# Altium project notus.PrjPcb
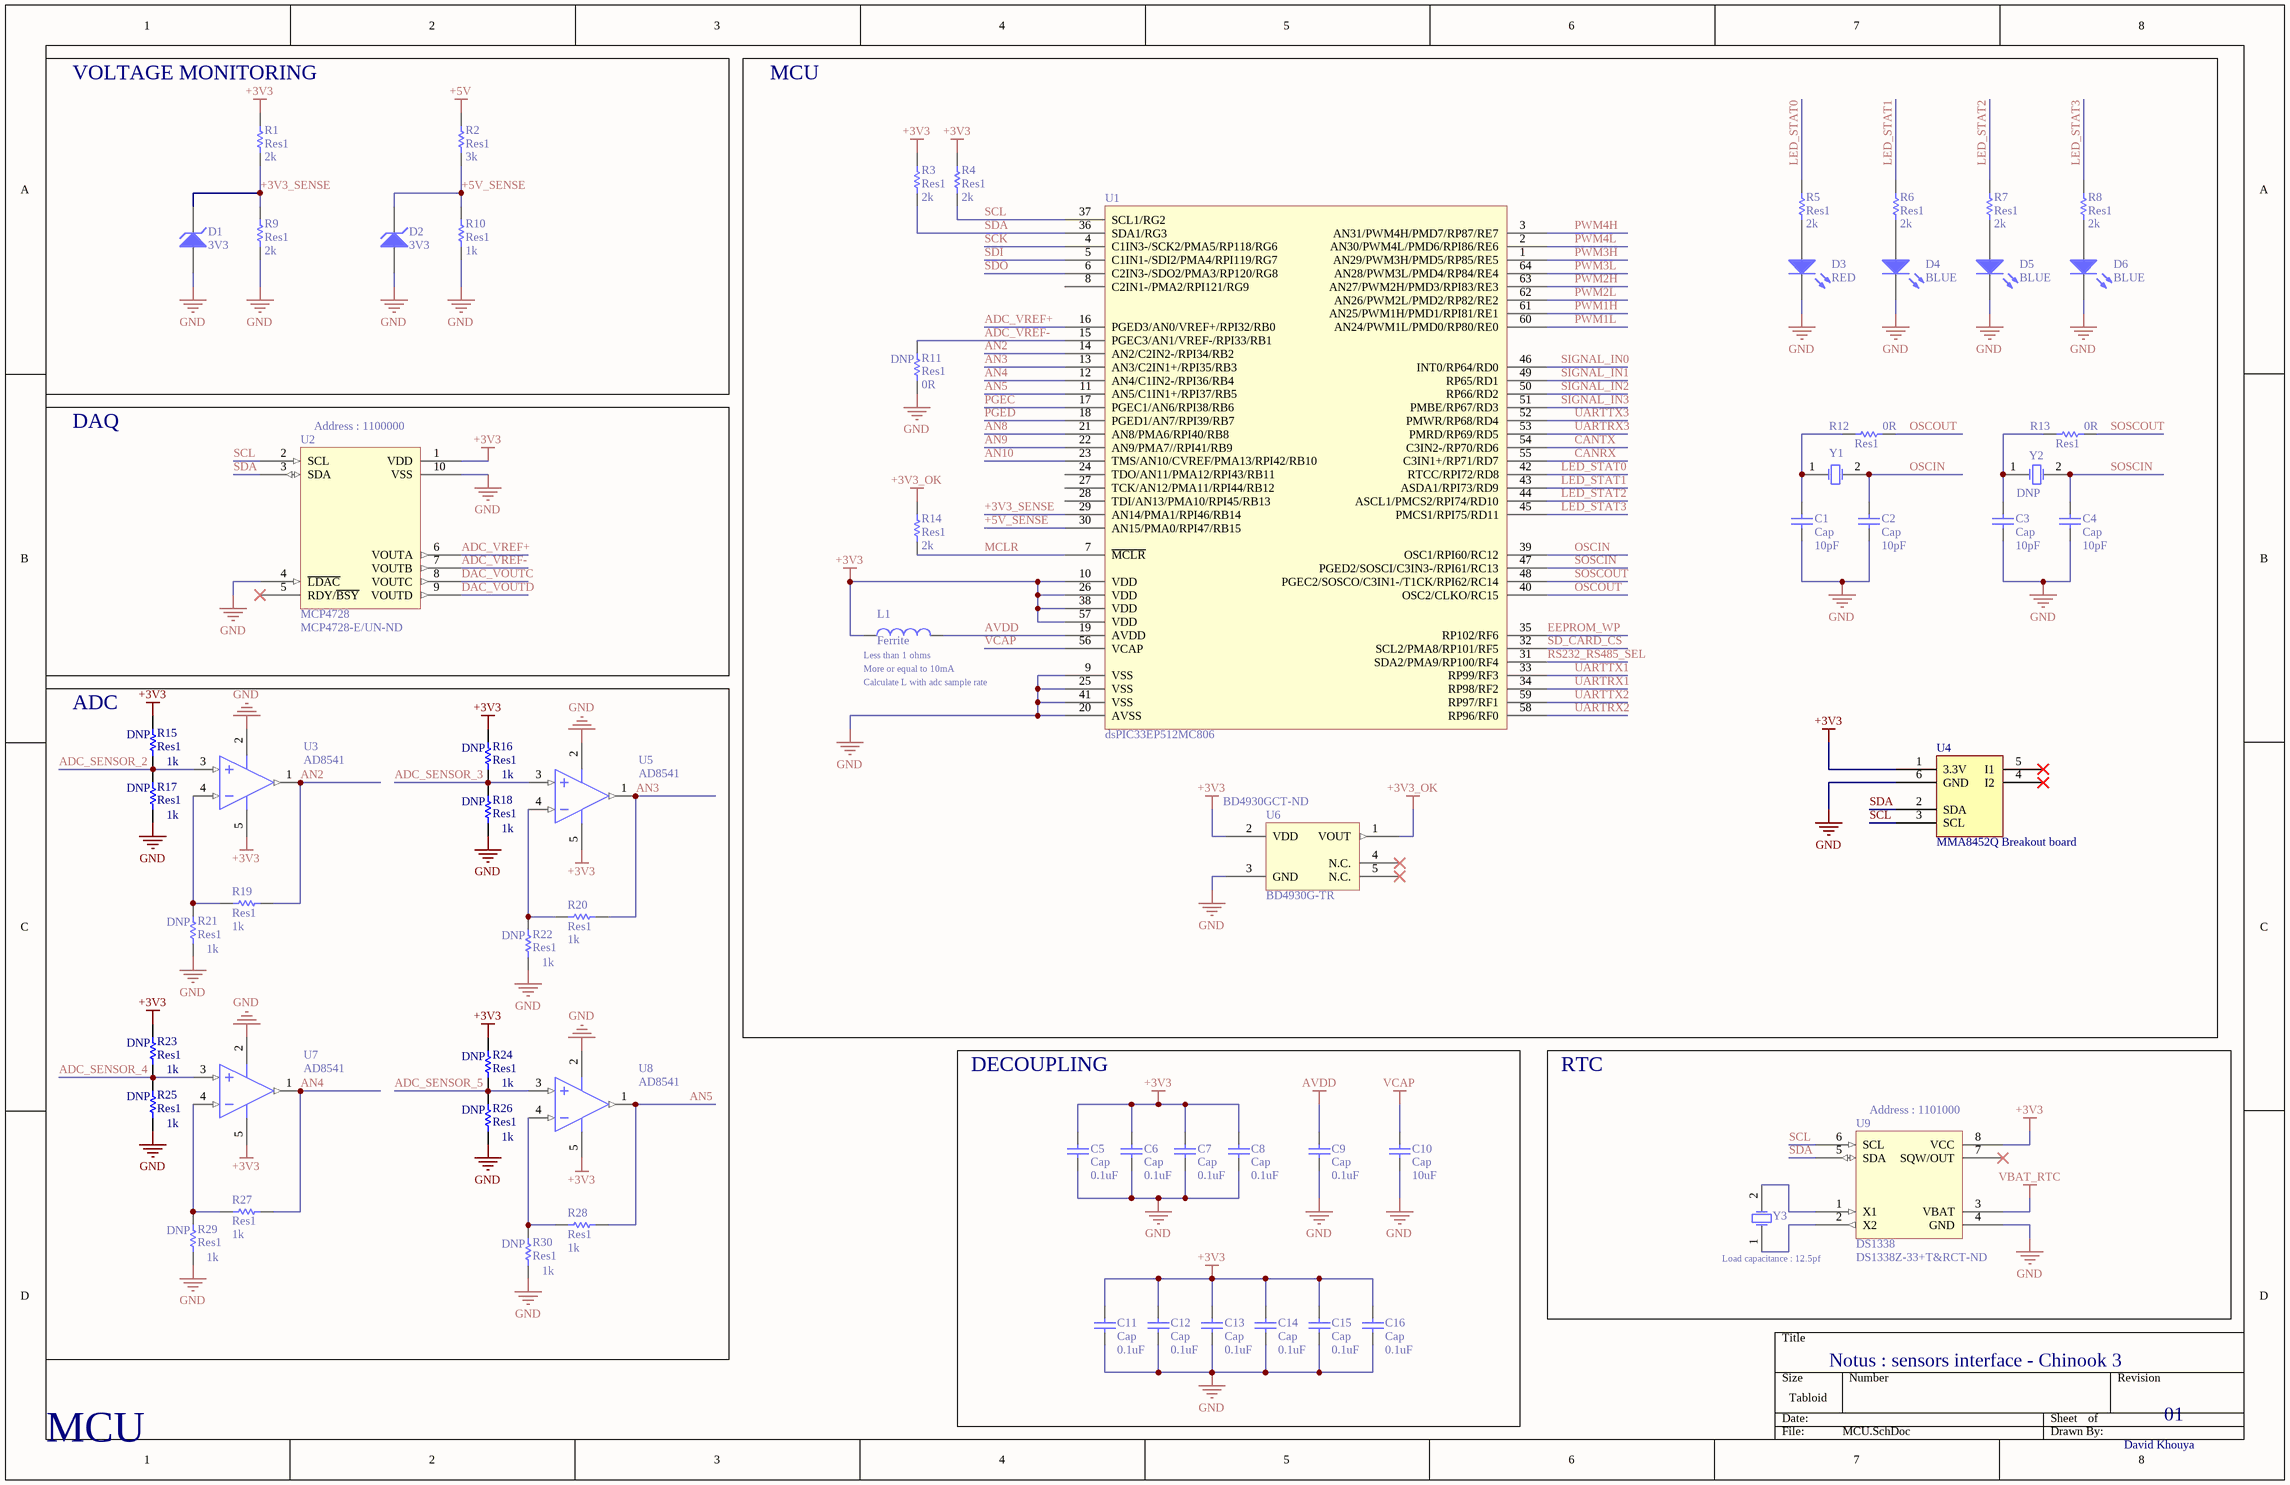
[diagram p0: MCU.SchDoc]
4 sheets, 110 parts. Net scope: global (net labels, ports and power ports of the same name join across sheets).
Board file: notus.PcbDoc
Sheets:
  MCU.SchDoc
  Memory.SchDoc
  Communication.SchDoc
  Connectors.SchDoc

## Sheet MCU.SchDoc
size Tabloid

### Parts
C1  Cap  value 10pF  [RESC2012N]
C2  Cap  value 10pF  [RESC2012N]
C3  Cap  value 10pF  [RESC2012N]
C4  Cap  value 10pF  [RESC2012N]
C5  Cap  value 0.1uF  [RESC2012N]
C6  Cap  value 0.1uF  [RESC2012N]
C7  Cap  value 0.1uF  [RESC2012N]
C8  Cap  value 0.1uF  [RESC2012N]
C9  Cap  value 0.1uF  [RESC2012N]
C10  Cap  value 10uF  [RESC2012N]
C11  Cap  value 0.1uF  [RESC2012N]
C12  Cap  value 0.1uF  [RESC2012N]
C13  Cap  value 0.1uF  [RESC2012N]
C14  Cap  value 0.1uF  [RESC2012N]
C15  Cap  value 0.1uF  [RESC2012N]
C16  Cap  value 0.1uF  [RESC2012N]
D1  3V3  [SOT23-3M]
D2  3V3  [SOT23-3M]
D3  RED  [0805_Diode]
D4  BLUE  [0805_Diode]
D5  BLUE  [0805_Diode]
D6  BLUE  [0805_Diode]
L1  Ferrite  [RESC2012N]
R1  Res1  value 2k  [RESC2012N]
R2  Res1  value 3k  [RESC2012N]
R3  Res1  value 2k  [RESC2012N]
R4  Res1  value 2k  [RESC2012N]
R5  Res1  value 2k  [RESC2012N]
R6  Res1  value 2k  [RESC2012N]
R7  Res1  value 2k  [RESC2012N]
R8  Res1  value 2k  [RESC2012N]
R9  Res1  value 2k  [RESC2012N]
R10  Res1  value 1k  [RESC2012N]
R11  Res1  value 0R  [RESC2012N]
R12  Res1  value 0R  [RESC2012N]
R13  Res1  value 0R  [RESC2012N]
R14  Res1  value 2k  [RESC2012N]
R15  Res1  value 1k  [RESC2012N]
R16  Res1  value 1k  [RESC2012N]
R17  Res1  value 1k  [RESC2012N]
R18  Res1  value 1k  [RESC2012N]
R19  Res1  value 1k  [RESC2012N]
R20  Res1  value 1k  [RESC2012N]
R21  Res1  value 1k  [RESC2012N]
R22  Res1  value 1k  [RESC2012N]
R23  Res1  value 1k  [RESC2012N]
R24  Res1  value 1k  [RESC2012N]
R25  Res1  value 1k  [RESC2012N]
R26  Res1  value 1k  [RESC2012N]
R27  Res1  value 1k  [RESC2012N]
R28  Res1  value 1k  [RESC2012N]
R29  Res1  value 1k  [RESC2012N]
R30  Res1  value 1k  [RESC2012N]
U1  dsPIC33EP512MC806  [TQFP-PT64_M]
U2  MCP4728  Supplier Part Number 1: MCP4728-E/UN-ND
U3  AD8541  [RT-5]
U4  MMA8452Q Breakout board  [MMA8452Q Breakout board]
U5  AD8541  [RT-5]
U6  BD4930G-TR  Supplier Part Number 1: BD4930GCT-ND  [SSOP5]
U7  AD8541  [RT-5]
U8  AD8541  [RT-5]
U9  DS1338  Supplier Part Number 1: DS1338Z-33+T&RCT-ND  [8SOIC-1]
Y1  (no value)  [HC49/4H_SMX]
Y2  (no value)  [HC49/4H_SMX]
Y3  (no value)  [crystalcustom]

### Blocks framed on the sheet
VOLTAGE MONITORING: D1 D2 R1 R2 R9 R10
MCU: C1-C4 D3-D6 L1 R3-R8 R11-R14 U1 U4 U6 Y1 Y2
DAQ: U2
ADC: R15-R30 U3 U5 U7 U8
DECOUPLING: C5-C16
RTC: U9 Y3

### Nets
+3V3: C5.2 C6.2 C7.2 C8.2 C11.2 C12.2 C13.2 C14.2 C15.2 C16.2 L1.1 R1.1 R3.1 R4.1 R15.1 R16.1 R23.1 R24.1 U1.10(VDD) U1.26(VDD) U1.38(VDD) U1.57(VDD) U2.1(VDD) U3.5(V+) U4.1(3.3V) U5.5(V+) U6.2(VDD) U7.5(V+) U8.5(V+) U9.8(VCC)
+3V3_OK: R14.1 U6.1(VOUT)
+5V: R2.1
AVDD: C9.2 L1.2 U1.19(AVDD)
GND: C1.1 C2.1 C3.1 C4.1 C5.1 C6.1 C7.1 C8.1 C9.1 C10.1 C11.1 C12.1 C13.1 C14.1 C15.1 C16.1 D1.1(A) D2.1(A) D3.2(K) D4.2(K) D5.2(K) D6.2(K) R9.2 R10.2 R11.2 R17.2 R18.2 R21.2 R22.2 R25.2 R26.2 R29.2 R30.2 U1.9(VSS) U1.20(AVSS) U1.25(VSS) U1.41(VSS) U2.4(~{LDAC}) U2.10(VSS) U3.2(V-) U4.6(GND) U5.2(V-) U6.3(GND) U7.2(V-) U8.2(V-) U9.4(GND)
VBAT_RTC: U9.3(VBAT)
VCAP: C10.2 U1.56(VCAP)
+3V3_SENSE: D1.2(K) R1.2 R9.1 U1.29(AN14/PMA1/RPI46/RB14)
+5V_SENSE: D2.2(K) R2.2 R10.1 U1.30(AN15/PMA0/RPI47/RB15)
ADC_SENSOR_2: R15.2 R17.1 U3.3(IN+_A)
ADC_SENSOR_3: R16.2 R18.1 U5.3(IN+_A)
ADC_SENSOR_4: R23.2 R25.1 U7.3(IN+_A)
ADC_SENSOR_5: R24.2 R26.1 U8.3(IN+_A)
ADC_VREF+: U1.16(PGED3/AN0/VREF+/RPI32/RB0) U2.6(VOUTA)
ADC_VREF-: R11.1 U1.15(PGEC3/AN1/VREF-/RPI33/RB1) U2.7(VOUTB)
AN2: R19.2 U1.14(AN2/C2IN2-/RPI34/RB2) U3.1(OUT_A)
AN3: R20.2 U1.13(AN3/C2IN1+/RPI35/RB3) U5.1(OUT_A)
AN4: R27.2 U1.12(AN4/C1IN2-/RPI36/RB4) U7.1(OUT_A)
AN5: R28.2 U1.11(AN5/C1IN1+/RPI37/RB5) U8.1(OUT_A)
AN8: U1.21(AN8/PMA6/RPI40/RB8)
AN9: U1.22(AN9/PMA7//RPI41/RB9)
AN10: U1.23(TMS/AN10/CVREF/PMA13/RPI42/RB10)
CANRX: U1.55(C3IN1+/RP71/RD7)
CANTX: U1.54(C3IN2-/RP70/RD6)
DAC_VOUTC: U2.8(VOUTC)
DAC_VOUTD: U2.9(VOUTD)
EEPROM_WP: U1.35(RP102/RF6)
LED_STAT0: R5.1 U1.42(RTCC/RPI72/RD8)
LED_STAT1: R6.1 U1.43(ASDA1/RPI73/RD9)
LED_STAT2: R7.1 U1.44(ASCL1/PMCS2/RPI74/RD10)
LED_STAT3: R8.1 U1.45(PMCS1/RPI75/RD11)
MCLR: R14.2 U1.7(~{MCLR})
OSCIN: C2.2 U1.39(OSC1/RPI60/RC12) Y1.2(OSC2)
OSCOUT: R12.1 U1.40(OSC2/CLKO/RC15)
PGEC: U1.17(PGEC1/AN6/RPI38/RB6)
PGED: U1.18(PGED1/AN7/RPI39/RB7)
PWM1H: U1.61(AN25/PWM1H/PMD1/RPI81/RE1)
PWM1L: U1.60(AN24/PWM1L/PMD0/RP80/RE0)
PWM2H: U1.63(AN27/PWM2H/PMD3/RPI83/RE3)
PWM2L: U1.62(AN26/PWM2L/PMD2/RP82/RE2)
PWM3H: U1.1(AN29/PWM3H/PMD5/RP85/RE5)
PWM3L: U1.64(AN28/PWM3L/PMD4/RP84/RE4)
PWM4H: U1.3(AN31/PWM4H/PMD7/RP87/RE7)
PWM4L: U1.2(AN30/PWM4L/PMD6/RPI86/RE6)
RS232_RS485_SEL: U1.31(SDA2/PMA9/RP100/RF4)
SCK: U1.4(C1IN3-/SCK2/PMA5/RP118/RG6)
SCL: R4.2 U1.37(SCL1/RG2) U2.2(SCL) U4.3(SCL) U9.6(SCL)
SD_CARD_CS: U1.32(SCL2/PMA8/RP101/RF5)
SDA: R3.2 U1.36(SDA1/RG3) U2.3(SDA) U4.2(SDA) U9.5(SDA)
SDI: U1.5(C1IN1-/SDI2/PMA4/RPI119/RG7)
SDO: U1.6(C2IN3-/SDO2/PMA3/RP120/RG8)
SIGNAL_IN0: U1.46(INT0/RP64/RD0)
SIGNAL_IN1: U1.49(RP65/RD1)
SIGNAL_IN2: U1.50(RP66/RD2)
SIGNAL_IN3: U1.51(PMBE/RP67/RD3)
SOSCIN: C4.2 U1.47(PGED2/SOSCI/C3IN3-/RPI61/RC13) Y2.2(OSC2)
SOSCOUT: R13.1 U1.48(PGEC2/SOSCO/C3IN1-/T1CK/RPI62/RC14)
UARTRX1: U1.34(RP98/RF2)
UARTRX2: U1.58(RP96/RF0)
UARTRX3: U1.53(PMRD/RP69/RD5)
UARTTX1: U1.33(RP99/RF3)
UARTTX2: U1.59(RP97/RF1)
UARTTX3: U1.52(PMWR/RP68/RD4)
NetC1_2: C1.2 R12.2 Y1.1(OSC1)
NetC3_2: C3.2 R13.2 Y2.1(OSC1)
NetD3_1: D3.1(A) R5.2
NetD4_1: D4.1(A) R6.2
NetD5_1: D5.1(A) R7.2
NetD6_1: D6.1(A) R8.2
NetR19_1: R19.1 R21.1 U3.4(IN-_A)
NetR20_1: R20.1 R22.1 U5.4(IN-_A)
NetR27_1: R27.1 R29.1 U7.4(IN-_A)
NetR28_1: R28.1 R30.1 U8.4(IN-_A)
NetU9_1: U9.1(X1) Y3.2(OSC2)
NetU9_2: U9.2(X2) Y3.1(OSC1)

Not connected (* = marked no-connect by the designer): U1 8(C2IN1-/PMA2/RPI121/RG9) 24(TDO/AN11/PMA12/RPI43/RB11) 27(TCK/AN12/PMA11/RPI44/RB12) 28(TDI/AN13/PMA10/RPI45/RB13); U2 5(RDY/~{BSY})*; U4 4(I2)* 5(I1)*; U6 4(N.C.)* 5(N.C.)*; U9 7(SQW/OUT)*

### Notes on the sheet
- (near U2) Address : 1100000
- (near L1) Less than 1 ohms
- (near L1) More or equal to 10mA
- (near L1) Calculate L with adc sample rate
- (near U9) Address : 1101000
- Load capacitance : 12.5pf
- Notus : sensors interface - Chinook 3
- 01
- MCU
- David Khouya

### Library data of the parts
C1-C16 = Cap: Capacitor; Published: 8-Jun-2000; LatestRevisionDate: 17-Jul-2002; LatestRevisionNote: Re-released for DXP Platform.; PackageReference: RAD-0.3; Publisher: Altium Limited; PackageDescription: Radial Cap, Thru-Hole; 2 Leads; 0.3 in Pin Spacing
D1 D2 = D Zener: Zener Diode; pin to pad: 2>3; Published: 8-Jun-2000; LatestRevisionDate: 17-Jul-2002; LatestRevisionNote: Re-released for DXP Platform.; PackageReference: DIODE-0.7; Publisher: Altium Limited; PackageDescription: Diode, Thru-Hole; 2 Leads; 0.7 in Pin Spacing
D3-D6 = LED0: Typical INFRARED GaAs LED; Published: 8-Jun-2000; LatestRevisionDate: 08-Jul-2005; LatestRevisionNote: Mech Layer 1 removed.; PackageReference: LED-0; Publisher: Altium Limited; PackageDescription: LED; 2 Leads
L1 = Inductor: Code_IEC: 1005; Published: 8-Jun-2000; LatestRevisionDate: 29-May-2009; LatestRevisionNote: IPC-7351 Footprint Added.; PackageReference: 0402-A; Publisher: Altium Limited; PackageDescription: Chip Inductor; Code_JEITA: 0402
R1-R30 = Res1: Resistor; Published: 8-Jun-2000; LatestRevisionDate: 17-Jul-2002; LatestRevisionNote: Re-released for DXP Platform.; PackageReference: AXIAL-0.3; Publisher: Altium Limited; PackageDescription: Axial Device, Thru-Hole; 2 Leads; 0.3 in Pin Spacing
  R11 R15-R18 R21-R26 R29 R30: DNP: DNP
U1 = dsPIC33EP512MC806: 16 bits microcontroller with Digital signal controller
U2 = MCP4728: 12-Bit, Quad Digital-to-Analog Converter with EEPROM Memory; Supplier 1: Digi-Key
U3 U5 U7 U8 = AD8541: CMOS Rail-to-Rail General-Purpose Amplifiers
U4 = MMA8452Q Breakout board: Triple axis accelerometer breakout board
U6 = BD4950G-TR: 5V Voltage supervisor; Supplier 1: Digi-Key
U9 = DS1338: I2C RTC with 56-Byte NV RAM; Supplier 1: Digi-Key
Y1-Y3 = XTAL: Crystal Oscillator; Published: 8-Jun-2000; LatestRevisionDate: 17-Jul-2002; LatestRevisionNote: Re-released for DXP Platform.; PackageReference: R38; Publisher: Altium Limited; PackageDescription: Crystal, Thru-Hole; 2 Leads; Body 3.1 x 8.2 mm (Dia.xH)
  Y2: DNP: DNP

## Sheet Memory.SchDoc
size A4
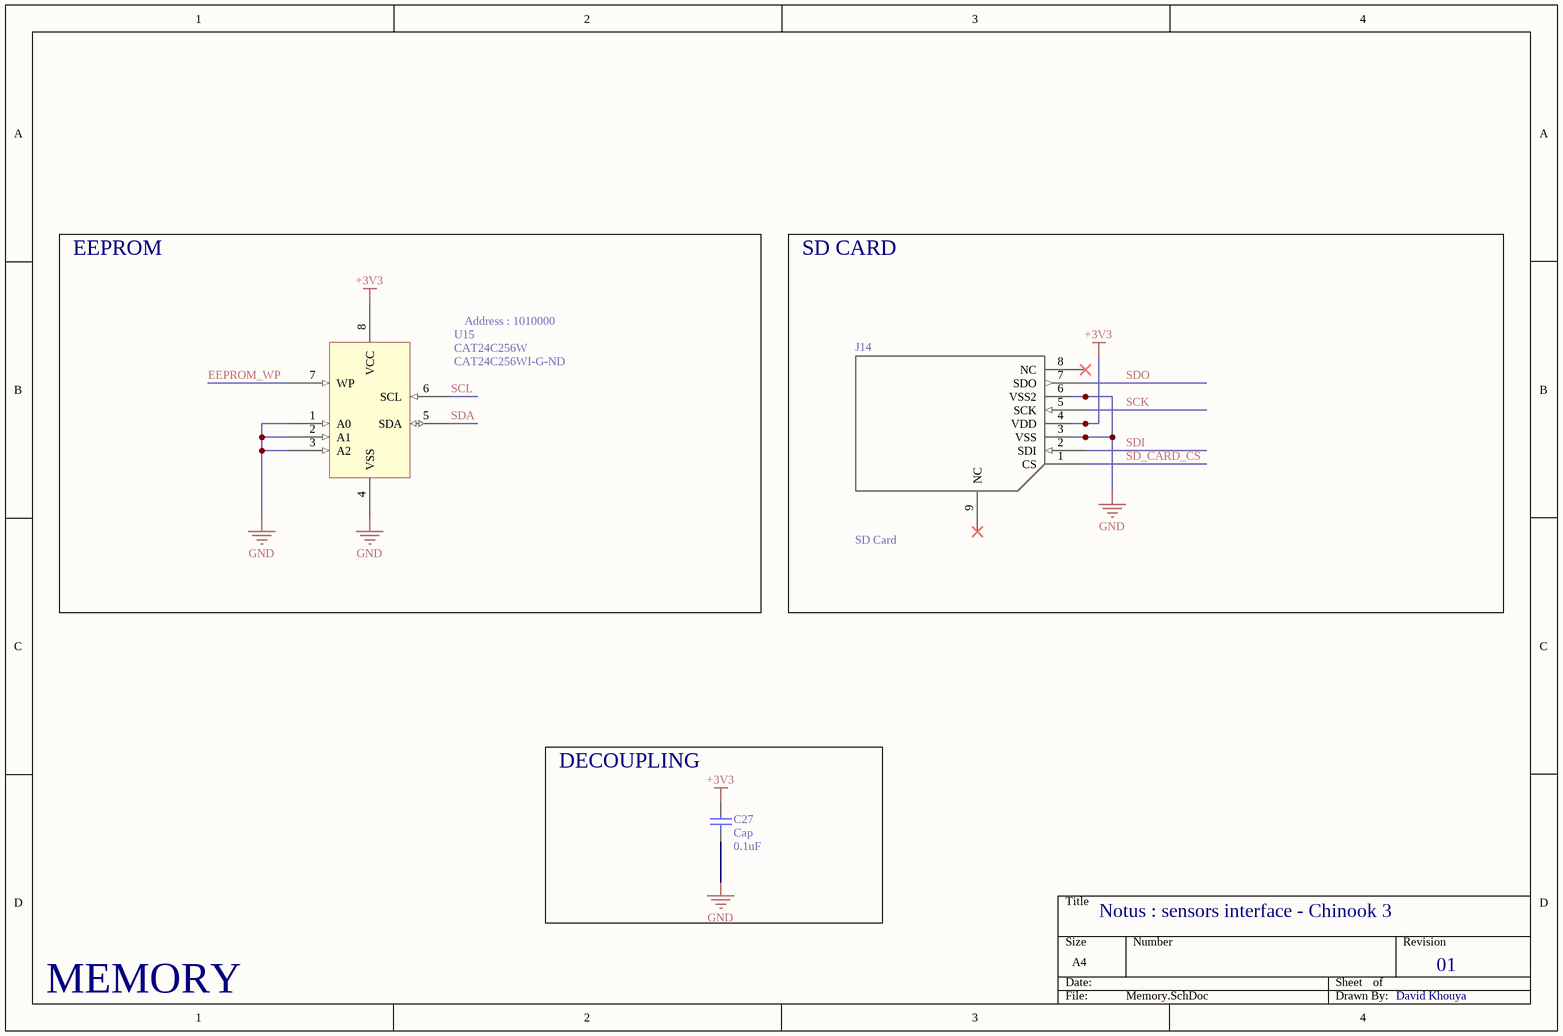
[diagram p1: Memory.SchDoc]

### Parts
C27  Cap  value 0.1uF  [RESC2012N]
J14  SD Card  [SD Card]
U15  CAT24C256W  Supplier Part Number 1: CAT24C256WI-G-ND  [8SOIC-2]

### Blocks framed on the sheet
EEPROM: U15
SD CARD: J14
DECOUPLING: C27

### Nets
+3V3: C27.2 J14.4(VDD) U15.8(VCC)
GND: C27.1 J14.3(VSS) J14.6(VSS2) U15.1(A0) U15.2(A1) U15.3(A2) U15.4(VSS)
EEPROM_WP: U15.7(WP)
SCK: J14.5(SCK)
SCL: U15.6(SCL)
SD_CARD_CS: J14.1(CS)
SDA: U15.5(SDA)
SDI: J14.2(SDI)
SDO: J14.7(SDO)

Not connected (* = marked no-connect by the designer): J14 8(NC)* 9(NC)*

### Notes on the sheet
- Address : 1010000
- Notus : sensors interface - Chinook 3
- 01
- MEMORY
- David Khouya

### Library data of the parts
C27 = Cap: Capacitor; Published: 8-Jun-2000; LatestRevisionDate: 17-Jul-2002; LatestRevisionNote: Re-released for DXP Platform.; PackageReference: RAD-0.3; Publisher: Altium Limited; PackageDescription: Radial Cap, Thru-Hole; 2 Leads; 0.3 in Pin Spacing
J14 = SD Card: SPI Sd card connector pinout
U15 = CAT24C256W: 256 kb I2C CMOS Serial  EEPROM; Supplier 1: Digi-Key

## Sheet Communication.SchDoc
size A4
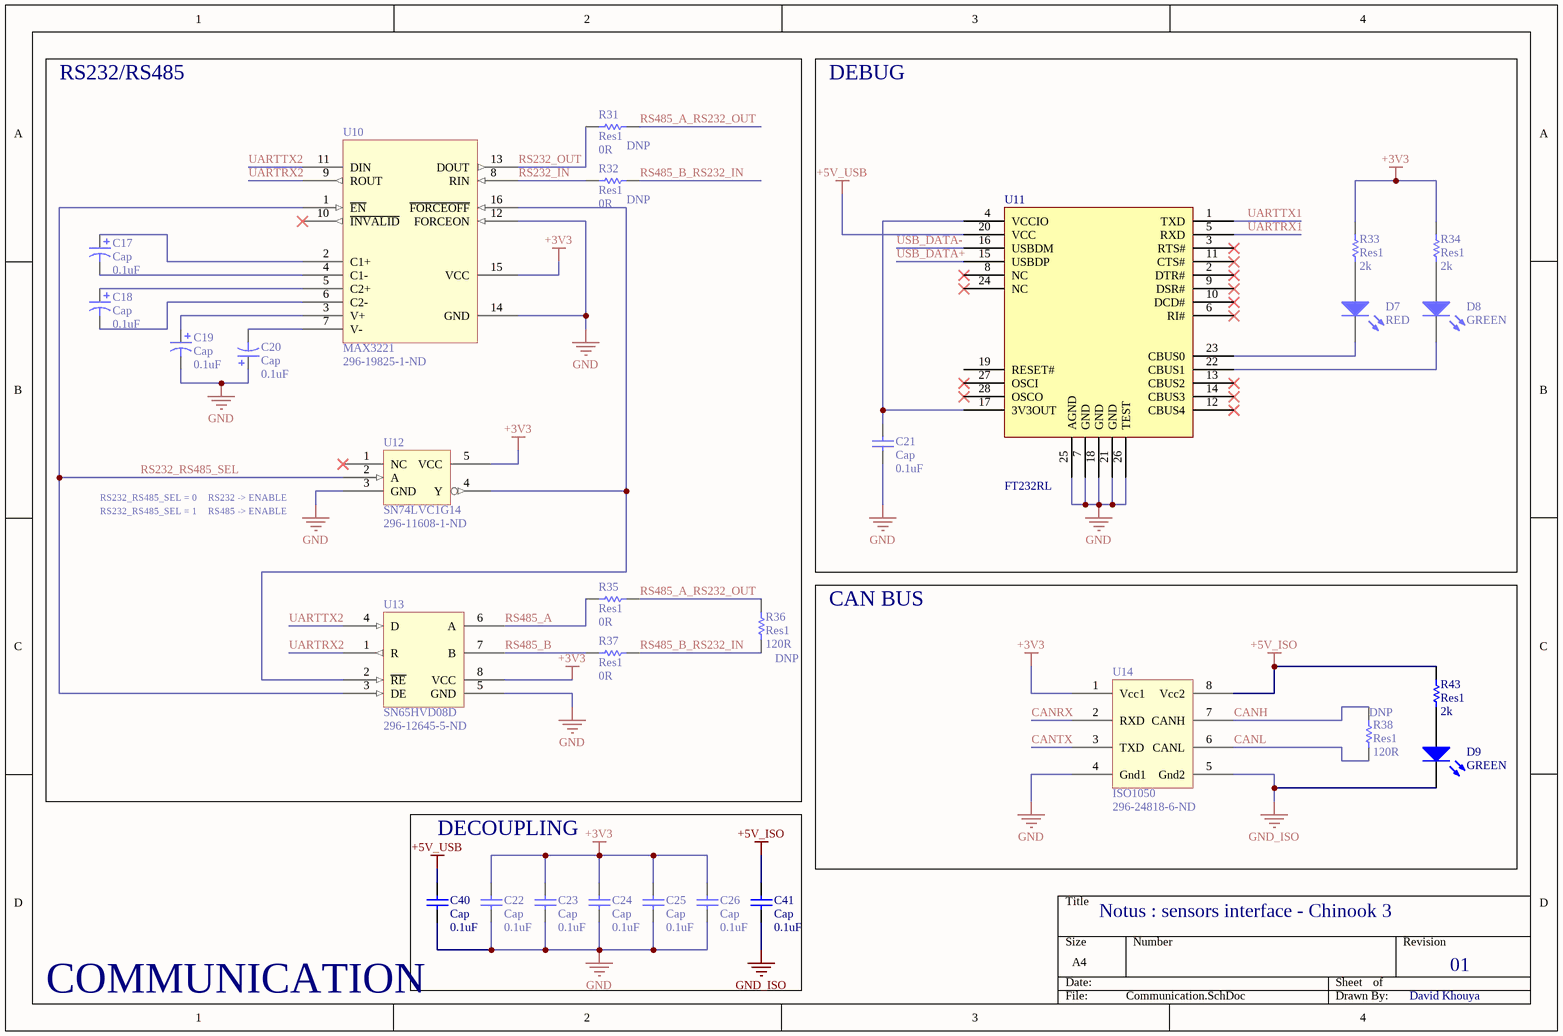
[diagram p2: Communication.SchDoc]

### Parts
C17  Cap  value 0.1uF  [C0805]
C18  Cap  value 0.1uF  [C0805]
C19  Cap  value 0.1uF  [C0805]
C20  Cap  value 0.1uF  [C0805]
C21  Cap  value 0.1uF  [RESC2012N]
C22  Cap  value 0.1uF  [RESC2012N]
C23  Cap  value 0.1uF  [RESC2012N]
C24  Cap  value 0.1uF  [RESC2012N]
C25  Cap  value 0.1uF  [RESC2012N]
C26  Cap  value 0.1uF  [RESC2012N]
C40  Cap  value 0.1uF  [RESC2012N]
C41  Cap  value 0.1uF  [RESC2012N]
D7  RED  [0805_Diode]
D8  GREEN  [0805_Diode]
D9  GREEN  [0805_Diode]
R31  Res1  value 0R  [RESC2012N]
R32  Res1  value 0R  [RESC2012N]
R33  Res1  value 2k  [RESC2012N]
R34  Res1  value 2k  [RESC2012N]
R35  Res1  value 0R  [RESC2012N]
R36  Res1  value 120R  [RESC2012N]
R37  Res1  value 0R  [RESC2012N]
R38  Res1  value 120R  [RESC2012N]
R43  Res1  value 2k  [RESC2012N]
U10  MAX3221  Supplier Part Number 1: 296-19825-1-ND  [SSOP16_M]
U11  FT232RL  [ssop-28]
U12  SN74LVC1G14  Supplier Part Number 1: 296-11608-1-ND  [SOT23-5AM]
U13  SN65HVD08D  Supplier Part Number 1: 296-12645-5-ND  [8SOIC-2]
U14  ISO1050  Supplier Part Number 1: 296-24818-6-ND  [SOP-8]

### Blocks framed on the sheet
RS232/RS485: C17-C20 R31 R32 R35-R37 U10 U12 U13
DEBUG: C21 D7 D8 R33 R34 U11
CAN BUS: D9 R38 R43 U14
DECOUPLING: C22-C26 C40 C41

### Nets
+3V3: C22.2 C23.2 C24.2 C25.2 C26.2 R33.1 R34.1 U10.15(VCC) U12.5(VCC) U13.8(VCC) U14.1(Vcc1)
+5V_ISO: C41.2 R43.1 U14.8(Vcc2)
+5V_USB: C40.2 U11.20(VCC)
GND: C19.2 C20.1 C21.1 C22.1 C23.1 C24.1 C25.1 C26.1 C40.1 U10.12(FORCEON) U10.14(GND) U11.7(GND) U11.18(GND) U11.21(GND) U11.25(AGND) U11.26(TEST) U12.3(GND) U13.5(GND) U14.4(Gnd1)
GND_ISO: C41.1 D9.2(K) U14.5(Gnd2)
CANH: R38.1 U14.7(CANH)
CANL: R38.2 U14.6(CANL)
CANRX: U14.2(RXD)
CANTX: U14.3(TXD)
RS232_IN: R32.1 U10.8(RIN)
RS232_OUT: R31.1 U10.13(DOUT)
RS232_RS485_SEL: U10.1(~{EN}) U12.2(A) U13.3(DE)
RS485_A: R35.1 U13.6(A)
RS485_A_RS232_OUT: R31.2 R35.2 R36.2
RS485_B: R37.1 U13.7(B)
RS485_B_RS232_IN: R32.2 R36.1 R37.2
UARTRX1: U11.5(RXD)
UARTRX2: U10.9(ROUT) U13.1(R)
UARTTX1: U11.1(TXD)
UARTTX2: U10.11(DIN) U13.4(D)
USB_DATA+: U11.15(USBDP)
USB_DATA-: U11.16(USBDM)
NetC17_1: C17.1 U10.2(C1+)
NetC17_2: C17.2 U10.4(C1-)
NetC18_1: C18.1 U10.5(C2+)
NetC18_2: C18.2 U10.6(C2-)
NetC19_1: C19.1 U10.3(V+)
NetC20_2: C20.2 U10.7(V-)
NetC21_2: C21.2 U11.4(VCCIO) U11.17(3V3OUT)
NetD7_1: D7.1(A) R33.2
NetD7_2: D7.2(K) U11.23(CBUS0)
NetD8_1: D8.1(A) R34.2
NetD8_2: D8.2(K) U11.22(CBUS1)
NetD9_1: D9.1(A) R43.2
NetU10_16: U10.16(~{FORCEOFF}) U12.4(Y) U13.2(~{RE})

Not connected (* = marked no-connect by the designer): U10 10(~{INVALID})*; U11 2(DTR#)* 3(RTS#)* 6(RI#)* 8(NC)* 9(DSR#)* 10(DCD#)* 11(CTS#)* 12(CBUS4)* 13(CBUS2)* 14(CBUS3)* 19(RESET#) 24(NC)* 27(OSCI)* 28(OSCO)*; U12 1(NC)*

### Notes on the sheet
- RS232_RS485_SEL = 0
- RS232_RS485_SEL = 1
- RS232 -> ENABLE
- RS485 -> ENABLE
- Notus : sensors interface - Chinook 3
- 01
- COMMUNICATION
- David Khouya

### Library data of the parts
C17-C20 = Cap Pol3: Polarized Capacitor (Surface Mount); Published: 8-Jun-2000; LatestRevisionDate: 29-May-2009; LatestRevisionNote: IPC-7351 Footprint Added.; PackageReference: C0805; Publisher: Altium Limited; PackageDescription: Chip Capacitor
C21-C26 C40 C41 = Cap: Capacitor; Published: 8-Jun-2000; LatestRevisionDate: 17-Jul-2002; LatestRevisionNote: Re-released for DXP Platform.; PackageReference: RAD-0.3; Publisher: Altium Limited; PackageDescription: Radial Cap, Thru-Hole; 2 Leads; 0.3 in Pin Spacing
D7-D9 = LED0: Typical INFRARED GaAs LED; Published: 8-Jun-2000; LatestRevisionDate: 08-Jul-2005; LatestRevisionNote: Mech Layer 1 removed.; PackageReference: LED-0; Publisher: Altium Limited; PackageDescription: LED; 2 Leads
R31-R38 R43 = Res1: Resistor; Published: 8-Jun-2000; LatestRevisionDate: 17-Jul-2002; LatestRevisionNote: Re-released for DXP Platform.; PackageReference: AXIAL-0.3; Publisher: Altium Limited; PackageDescription: Axial Device, Thru-Hole; 2 Leads; 0.3 in Pin Spacing
  R31 R32 R36 R38: DNP: DNP
U10 = MAX3221: RS232 to TTL; Supplier 1: Digi-Key
U11 = FT232RL: USB UART IC
U12 = SN74LVC1G14: Inverter Gate; Supplier 1: Digi-Key
U13 = SN65HVD08D: RS485 to TTL; Supplier 1: Digi-Key
U14 = ISO1050: ISOLATED CAN TRANSCEIVER; Supplier 1: Digi-Key

## Sheet Connectors.SchDoc
size A4
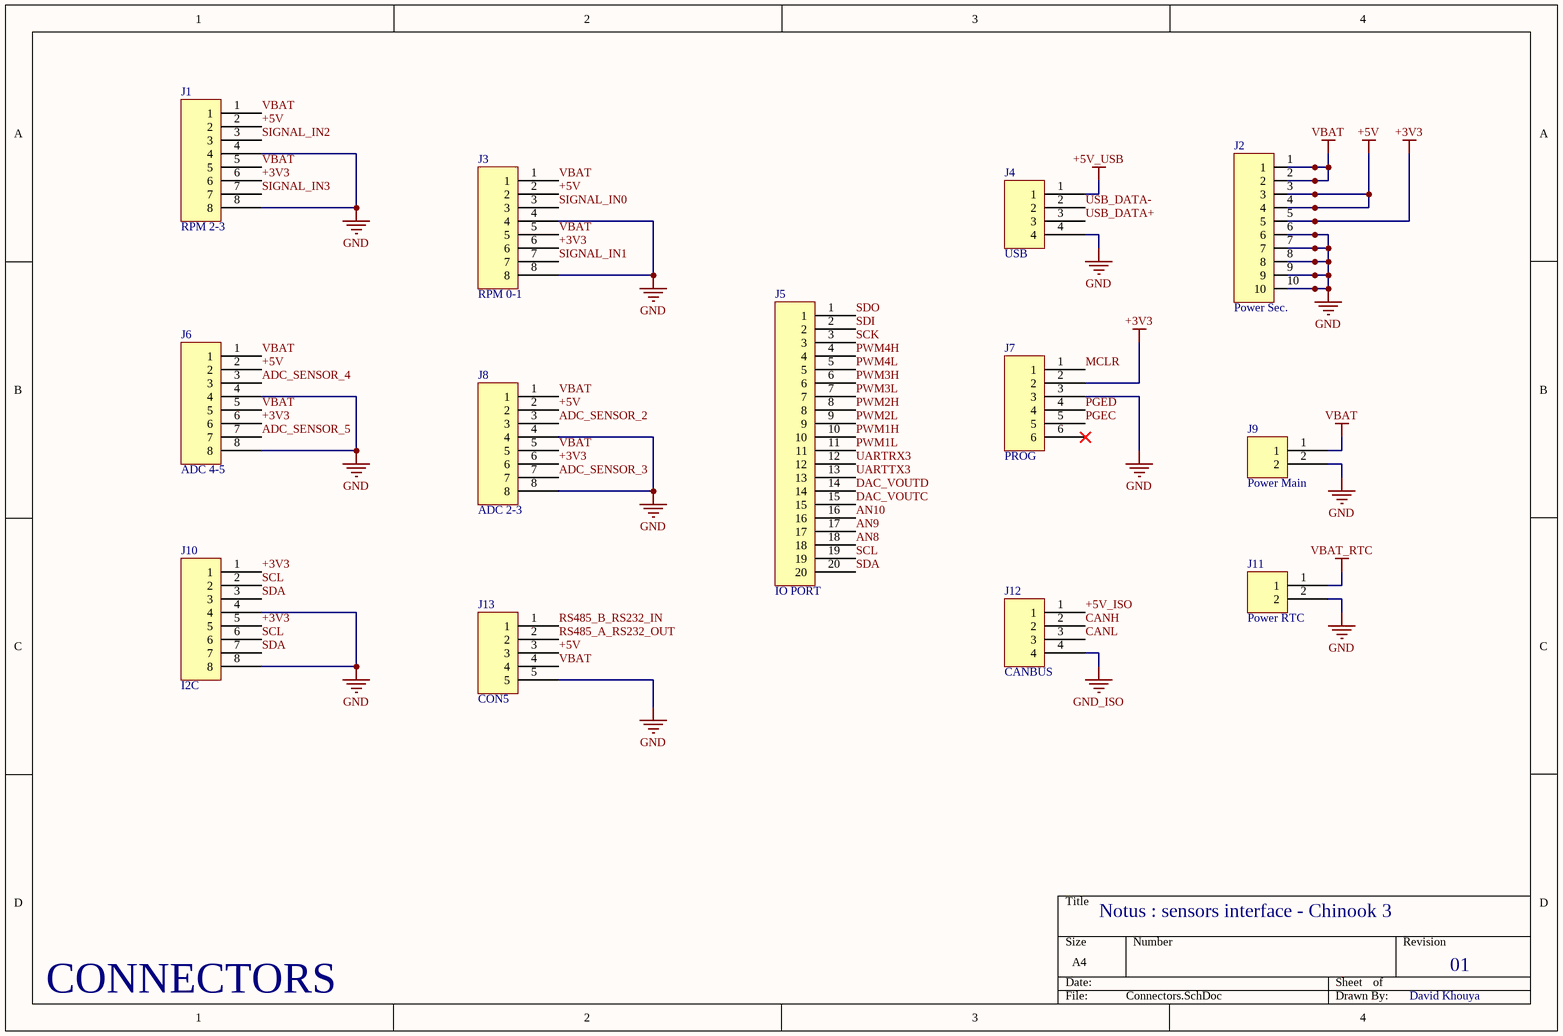
[diagram p3: Connectors.SchDoc]

### Parts
J1  RPM 2-3  [1633600000]
J2  Power Sec.  [104652-1]
J3  RPM 0-1  [1633600000]
J4  USB  [AU-Y1007-R]
J5  IO PORT  [104652-2]
J6  ADC 4-5  [1633600000]
J7  PROG  [A31411-ND]
J8  ADC 2-3  [1633600000]
J9  Power Main  [XT60_CON]
J10  I2C  [1633600000]
J11  Power RTC  [BS-1225-PC]
J12  CANBUS  [CON4_100MILS]
J13  CON5  [1607070000]

### Nets
+3V3: J1.6 J2.5 J3.6 J6.6 J7.2 J8.6 J10.1 J10.5
+5V: J1.2 J2.3 J2.4 J3.2 J6.2 J8.2 J13.3
+5V_ISO: J12.1
+5V_USB: J4.1
GND: J1.4 J1.8 J2.6 J2.7 J2.8 J2.9 J2.10 J3.4 J3.8 J4.4 J6.4 J6.8 J7.3 J8.4 J8.8 J9.2 J10.4 J10.8 J11.2 J13.5
GND_ISO: J12.4
VBAT: J1.1 J1.5 J2.1 J2.2 J3.1 J3.5 J6.1 J6.5 J8.1 J8.5 J9.1 J13.4
VBAT_RTC: J11.1
ADC_SENSOR_2: J8.3
ADC_SENSOR_3: J8.7
ADC_SENSOR_4: J6.3
ADC_SENSOR_5: J6.7
AN8: J5.18
AN9: J5.17
AN10: J5.16
CANH: J12.2
CANL: J12.3
DAC_VOUTC: J5.15
DAC_VOUTD: J5.14
MCLR: J7.1
PGEC: J7.5
PGED: J7.4
PWM1H: J5.10
PWM1L: J5.11
PWM2H: J5.8
PWM2L: J5.9
PWM3H: J5.6
PWM3L: J5.7
PWM4H: J5.4
PWM4L: J5.5
RS485_A_RS232_OUT: J13.2
RS485_B_RS232_IN: J13.1
SCK: J5.3
SCL: J5.19 J10.2 J10.6
SDA: J5.20 J10.3 J10.7
SDI: J5.2
SDO: J5.1
SIGNAL_IN0: J3.3
SIGNAL_IN1: J3.7
SIGNAL_IN2: J1.3
SIGNAL_IN3: J1.7
UARTRX3: J5.12
UARTTX3: J5.13
USB_DATA+: J4.3
USB_DATA-: J4.2

Not connected (* = marked no-connect by the designer): J7 6*

### Notes on the sheet
- Notus : sensors interface - Chinook 3
- 01
- CONNECTORS
- David Khouya

### Library data of the parts
J1 J3 J6 J8 J10 = CON8: 8 pins connector
J2 = CON10: 10 pins connector
J4 J12 = CON4: 4 pins connector
J5 = CON20: 20 pins connector
J7 = CON6: 6 pins connectors
J9 J11 = CON2: 2 pins connector
J13 = CON5: 5 pins connector

## Nets that join several sheets
+3V3: MCU (30 pins), Memory (C27.2 J14.4 U15.8), Communication (11 pins), Connectors (8 pins)
+5V: MCU (R2.1), Connectors (7 pins)
+5V_ISO: Communication (C41.2 R43.1 U14.8), Connectors (J12.1)
+5V_USB: Communication (C40.2 U11.20), Connectors (J4.1)
GND: MCU (46 pins), Memory (7 pins), Communication (19 pins), Connectors (20 pins)
GND_ISO: Communication (C41.1 D9.2 U14.5), Connectors (J12.4)
VBAT_RTC: MCU (U9.3), Connectors (J11.1)
ADC_SENSOR_2: MCU (R15.2 R17.1 U3.3), Connectors (J8.3)
ADC_SENSOR_3: MCU (R16.2 R18.1 U5.3), Connectors (J8.7)
ADC_SENSOR_4: MCU (R23.2 R25.1 U7.3), Connectors (J6.3)
ADC_SENSOR_5: MCU (R24.2 R26.1 U8.3), Connectors (J6.7)
AN8: MCU (U1.21), Connectors (J5.18)
AN9: MCU (U1.22), Connectors (J5.17)
AN10: MCU (U1.23), Connectors (J5.16)
CANH: Communication (R38.1 U14.7), Connectors (J12.2)
CANL: Communication (R38.2 U14.6), Connectors (J12.3)
CANRX: MCU (U1.55), Communication (U14.2)
CANTX: MCU (U1.54), Communication (U14.3)
DAC_VOUTC: MCU (U2.8), Connectors (J5.15)
DAC_VOUTD: MCU (U2.9), Connectors (J5.14)
EEPROM_WP: MCU (U1.35), Memory (U15.7)
MCLR: MCU (R14.2 U1.7), Connectors (J7.1)
PGEC: MCU (U1.17), Connectors (J7.5)
PGED: MCU (U1.18), Connectors (J7.4)
PWM1H: MCU (U1.61), Connectors (J5.10)
PWM1L: MCU (U1.60), Connectors (J5.11)
PWM2H: MCU (U1.63), Connectors (J5.8)
PWM2L: MCU (U1.62), Connectors (J5.9)
PWM3H: MCU (U1.1), Connectors (J5.6)
PWM3L: MCU (U1.64), Connectors (J5.7)
PWM4H: MCU (U1.3), Connectors (J5.4)
PWM4L: MCU (U1.2), Connectors (J5.5)
RS232_RS485_SEL: MCU (U1.31), Communication (U10.1 U12.2 U13.3)
RS485_A_RS232_OUT: Communication (R31.2 R35.2 R36.2), Connectors (J13.2)
RS485_B_RS232_IN: Communication (R32.2 R36.1 R37.2), Connectors (J13.1)
SCK: MCU (U1.4), Memory (J14.5), Connectors (J5.3)
SCL: MCU (5 pins), Memory (U15.6), Connectors (J5.19 J10.2 J10.6)
SD_CARD_CS: MCU (U1.32), Memory (J14.1)
SDA: MCU (5 pins), Memory (U15.5), Connectors (J5.20 J10.3 J10.7)
SDI: MCU (U1.5), Memory (J14.2), Connectors (J5.2)
SDO: MCU (U1.6), Memory (J14.7), Connectors (J5.1)
SIGNAL_IN0: MCU (U1.46), Connectors (J3.3)
SIGNAL_IN1: MCU (U1.49), Connectors (J3.7)
SIGNAL_IN2: MCU (U1.50), Connectors (J1.3)
SIGNAL_IN3: MCU (U1.51), Connectors (J1.7)
UARTRX1: MCU (U1.34), Communication (U11.5)
UARTRX2: MCU (U1.58), Communication (U10.9 U13.1)
UARTRX3: MCU (U1.53), Connectors (J5.12)
UARTTX1: MCU (U1.33), Communication (U11.1)
UARTTX2: MCU (U1.59), Communication (U10.11 U13.4)
UARTTX3: MCU (U1.52), Connectors (J5.13)
USB_DATA+: Communication (U11.15), Connectors (J4.3)
USB_DATA-: Communication (U11.16), Connectors (J4.2)